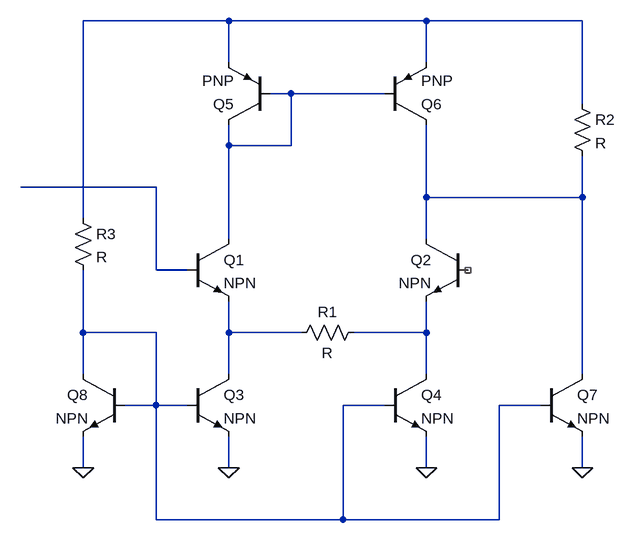
[diagram p0: schematic Draft2.asc]
Draft2.asc, the LTspice schematic file:
Version 4
SHEET 1 880 680
WIRE 0 -304 -224 -304
WIRE 304 -304 0 -304
WIRE 544 -304 304 -304
WIRE 0 -240 0 -304
WIRE 304 -240 304 -304
WIRE 96 -192 64 -192
WIRE 240 -192 96 -192
WIRE 544 -176 544 -304
WIRE 0 -112 0 -144
WIRE 96 -112 96 -192
WIRE 96 -112 0 -112
WIRE -112 -48 -320 -48
WIRE 304 -32 304 -144
WIRE 544 -32 544 -96
WIRE 544 -32 304 -32
WIRE -224 0 -224 -304
WIRE 0 32 0 -112
WIRE 304 32 304 -32
WIRE -112 80 -112 -48
WIRE -64 80 -112 80
WIRE -224 176 -224 80
WIRE -112 176 -224 176
WIRE 0 176 0 128
WIRE 112 176 0 176
WIRE 304 176 304 128
WIRE 304 176 192 176
WIRE -224 240 -224 176
WIRE 0 240 0 176
WIRE 304 240 304 176
WIRE 544 240 544 -32
WIRE -112 288 -112 176
WIRE -112 288 -160 288
WIRE -64 288 -112 288
WIRE 240 288 176 288
WIRE 480 288 416 288
WIRE -224 384 -224 336
WIRE 0 384 0 336
WIRE 304 384 304 336
WIRE 544 384 544 336
WIRE -112 464 -112 288
WIRE 176 464 176 288
WIRE 176 464 -112 464
WIRE 416 464 416 288
WIRE 416 464 176 464
FLAG 0 384 0
FLAG 304 384 0
FLAG 544 384 0
FLAG -224 384 0
SYMBOL npn2 -64 32 R0
SYMATTR InstName Q1
SYMBOL npn2 368 32 M0
SYMATTR InstName Q2
SYMBOL res 208 160 R90
WINDOW 0 0 56 VBottom 2
WINDOW 3 32 56 VTop 2
SYMATTR InstName R1
SYMBOL npn2 -64 240 R0
SYMATTR InstName Q3
SYMBOL npn2 240 240 R0
SYMATTR InstName Q4
SYMBOL pnp 64 -144 R180
SYMATTR InstName Q5
SYMBOL pnp 240 -144 M180
SYMATTR InstName Q6
SYMBOL npn2 480 240 R0
SYMATTR InstName Q7
SYMBOL res 528 -192 R0
SYMATTR InstName R2
SYMBOL res -240 -16 R0
SYMATTR InstName R3
SYMBOL npn2 -160 240 M0
SYMATTR InstName Q8

The netlist it stands for:
* Draft2.asc
Q1 N002 N003 N006 0 NPN
Q2 N004 NC_01 N007 0 NPN
R1 N007 N006 R
Q3 N006 N005 0 0 NPN
Q4 N007 N005 0 0 NPN
Q5 N002 N002 N001 0 PNP
Q6 N004 N002 N001 0 PNP
Q7 N004 N005 0 0 NPN
R2 N001 N004 R
R3 N001 N005 R
Q8 N005 N005 0 0 NPN
.model NPN NPN
.model PNP PNP
.lib standard.bjt
.backanno
.end